# EAGLE design IRK (EAGLE 6.5.0)
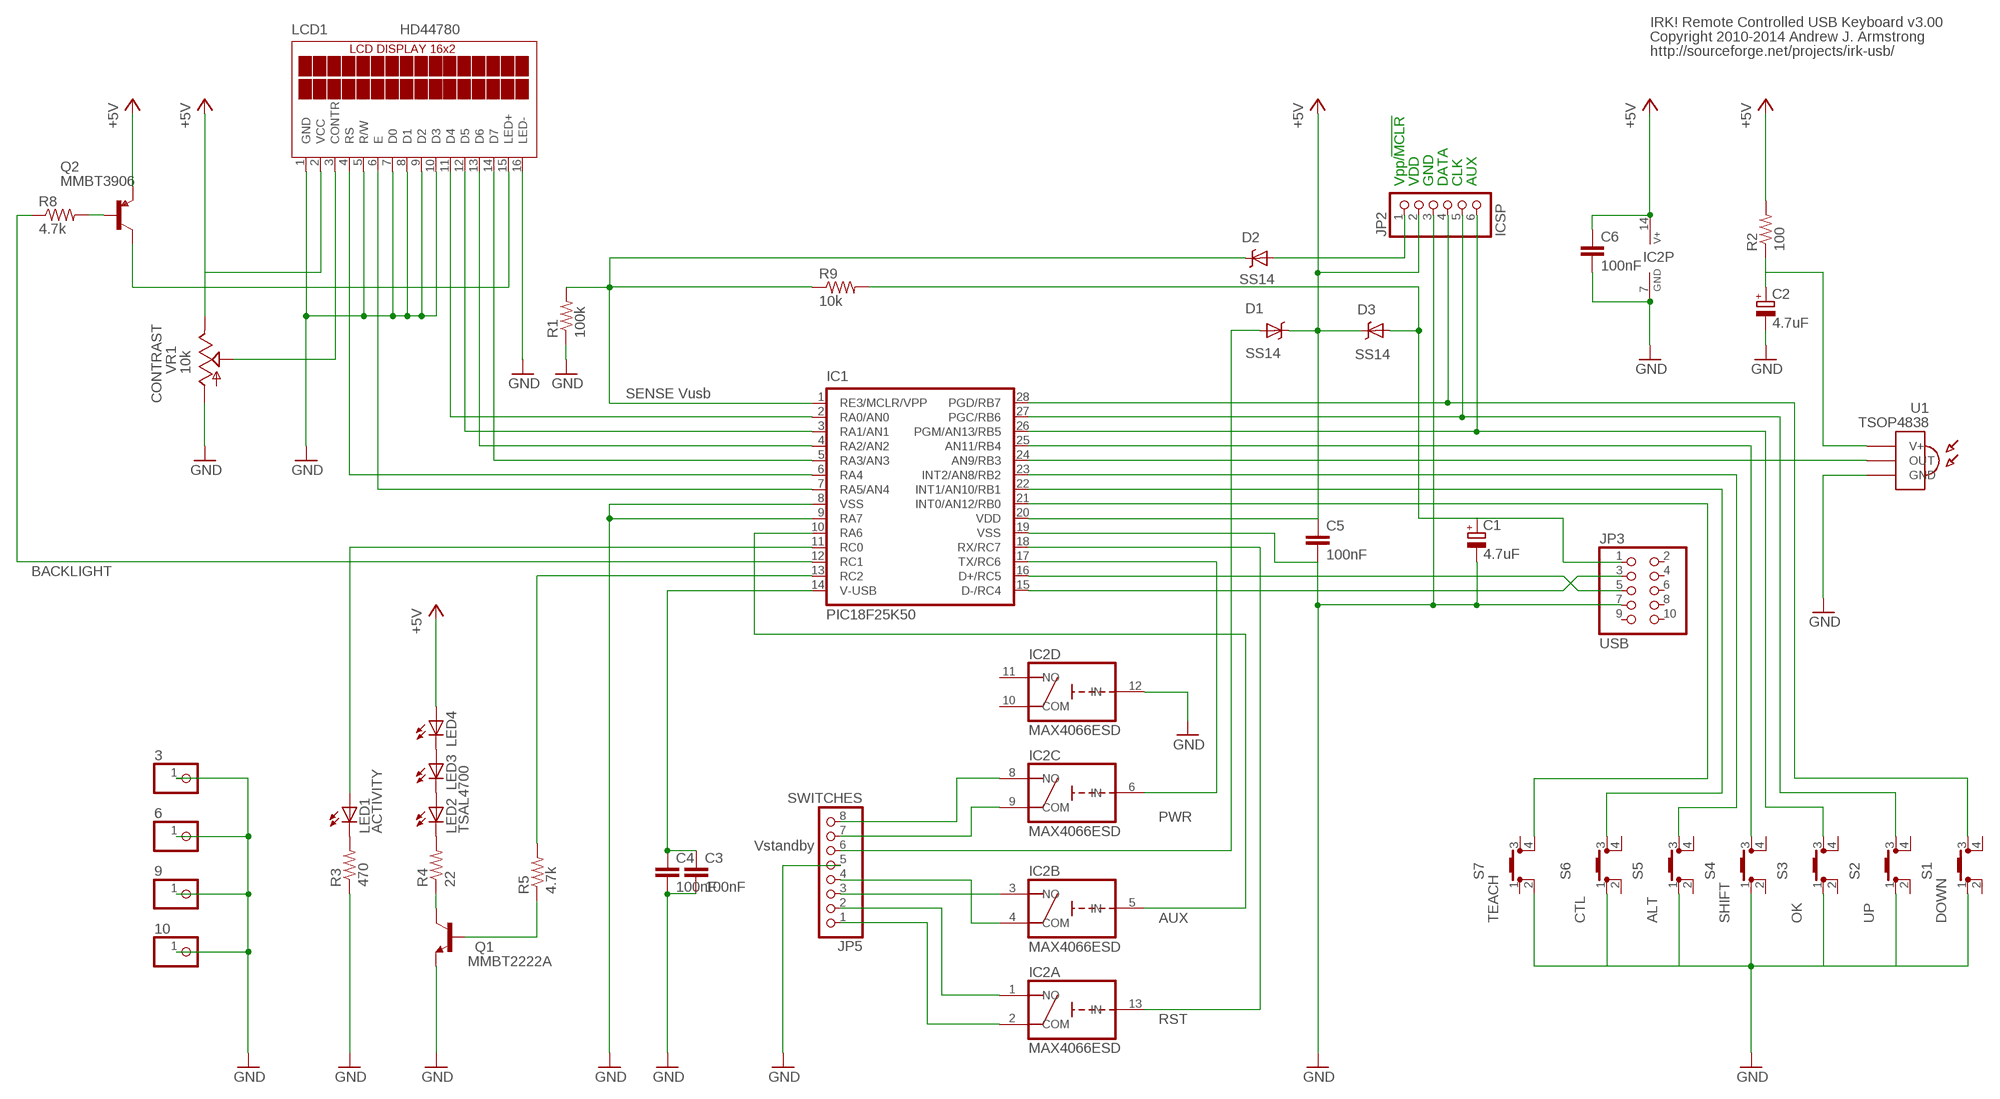
[diagram p0: schematic, sheet 1]

## Parts
3  PINHD-1X1  [1X01]
6  PINHD-1X1  [1X01]
9  PINHD-1X1  [1X01]
10  PINHD-1X1  [1X01]
C1  4.7uF  CPOL-EUSMCA  [SMC_A]
C2  4.7uF  CPOL-EUSMCA  [SMC_A]
C3  100nF  C-EUC0805  [C0805]
C4  100nF  C-EUC0805  [C0805]
C5  100nF  C-EUC0805  [C0805]
C6  100nF  C-EUC0805  [C0805]
D1  SS14  [SMA-DIODE]
D2  SS14  [SMA-DIODE]
D3  SS14  [SMA-DIODE]
IC1  PIC18F25K50  PIC18F25K50SO28W  [SO28W]
IC2  MAX4066ESD  [SO14]
JP2  ICSP  PINHD-1X6  [1X06]
JP3  USB  PINHD-2X5  [2X05]
JP5  SWITCHES  PINHD-1X8  [1X08]
LCD1  HD44780  [LCD_16X2]
LED1  ACTIVITY  LED5MM  [LED5MM]
LED2  TSAL4700  LED5MM  [LED5MM]
LED3  LED5MM  [LED5MM]
LED4  LED5MM  [LED5MM]
Q1  MMBT2222A  [SOT23]
Q2  MMBT3906  MMBT3906SOT23  [SOT23]
R1  100k  R-US_M1206  [M1206]
R2  100  R-US_M1206  [M1206]
R3  470  R-US_M1206  [M1206]
R4  22  R-US_M1206  [M1206]
R5  4.7k  R-US_M1206  [M1206]
R8  4.7k  R-US_M1206  [M1206]
R9  10k  R-US_M1206  [M1206]
S1  DOWN  C&K-PTS525-SM10  [PTH525-SM10]
S2  UP  C&K-PTS525-SM10  [PTH525-SM10]
S3  OK  C&K-PTS525-SM10  [PTH525-SM10]
S4  SHIFT  C&K-PTS525-SM10  [PTH525-SM10]
S5  ALT  C&K-PTS525-SM10  [PTH525-SM10]
S6  CTL  C&K-PTS525-SM10  [PTH525-SM10]
S7  TEACH  C&K-PTS525-SM10  [PTH525-SM10]
U1  TSOP4838  [TSOP18XX]
VR1  10k  TRIMPOT3303W  [3303W]

## Nets
+5V: C5.1 C6.1 D1.K D3.K IC1.20(VDD) IC2.14(P:V+) JP2.2 LCD1.2(VCC) LED4.A Q2.2(E) R2.2 VR1.3(E)
AUX: IC1.10(RA6) IC2.5(B:IN)
GND: 3.1 6.1 9.1 10.1 C1.- C2.- C3.2 C4.2 C5.2 C6.2 IC1.8(VSS) IC1.9(RA7) IC1.19(VSS) IC2.7(P:GND) IC2.12(D:IN) JP2.3 JP3.7 JP5.5 LCD1.1(GND) LCD1.5(R/W) LCD1.7(D0) LCD1.8(D1) LCD1.9(D2) LCD1.10(D3) LCD1.16(LED-) Q1.2(E) R1.1 R3.1 S1.1 S2.1 S3.1 S4.1 S5.1 S6.1 S7.2 U1.GND VR1.1(A)
N$1: IC1.2(RA0/AN0) LCD1.11(D4)
N$2: IC1.3(RA1/AN1) LCD1.12(D5)
N$3: IC1.4(RA2/AN2) LCD1.13(D6)
N$4: IC1.5(RA3/AN3) LCD1.14(D7)
N$5: IC1.6(RA4) LCD1.4(RS)
N$6: IC1.7(RA5/AN4) LCD1.6(E)
N$7: LCD1.3(CONTR) VR1.2(S)
N$8: D2.K IC1.1(RE3/MCLR/VPP) R1.2 R9.1
N$10: IC1.24(AN9/RB3) U1.OUT
N$11: IC2.2(A:COM) JP5.1
N$12: IC1.28(PGD/RB7) JP2.4 S1.3
N$13: IC1.27(PGC/RB6) JP2.5 S2.3
N$14: IC1.26(PGM/AN13/RB5) JP2.6 S3.3
N$15: IC1.25(AN11/RB4) S4.3
N$16: IC1.23(INT2/AN8/RB2) S5.3
N$17: IC1.22(INT1/AN10/RB1) S6.3
N$18: IC1.21(INT0/AN12/RB0) S7.4
N$19: C3.1 C4.1 IC1.14(V-USB)
N$20: LED1.K(C) R3.2
N$21: C1.+ D3.A JP3.1 R9.2
N$22: IC2.1(A:NO) JP5.2
N$23: IC1.16(D+/RC5) JP3.5
N$24: IC1.15(D-/RC4) JP3.3
N$25: LED2.K(C) R4.2
N$26: LED2.A LED3.K(C)
N$27: LED3.A LED4.K(C)
N$28: IC1.13(RC2) R5.2
N$29: Q1.1(B) R5.1
N$30: Q1.3(C) R4.1
N$31: LCD1.15(LED+) Q2.3(C)
N$33: IC2.4(B:COM) JP5.4
N$34: IC1.12(RC1) R8.1
N$35: IC2.3(B:NO) JP5.3
N$36: Q2.1(B) R8.2
N$39: IC2.9(C:COM) JP5.7
N$40: IC2.8(C:NO) JP5.8
N$45: D2.A JP2.1
N$46: IC1.11(RC0) LED1.A
N$50: C2.+ R2.1 U1.VCC(V+)
PWR: IC1.17(TX/RC6) IC2.6(C:IN)
RST: IC1.18(RX/RC7) IC2.13(A:IN)
VSB: D1.A JP5.6
Unconnected: IC2.10(D:COM) IC2.11(D:NO) JP3.2 JP3.4 JP3.6 JP3.8 JP3.9 JP3.10 S1.2 S1.4 S2.2 S2.4 S3.2 S3.4 S4.2 S4.4 S5.2 S5.4 S6.2 S6.4 S7.1 S7.3

## Notes on the sheet
- IRK! Remote Controlled USB Keyboard v3.00
- Copyright 2010-2014 Andrew J. Armstrong
- http://sourceforge.net/projects/irk-usb/
- Vpp/!MCLR | VDD | GND | DATA | CLK | AUX
- SENSE Vusb
- CONTRAST
- BACKLIGHT
- PWR
- Vstandby
- AUX
- RST

## Library data of the parts
3 6 9 10 = pinhead:PINHD-1X1: PIN HEADER
C1 C2 = rcl:CPOL-EU: POLARIZED CAPACITOR, European symbol
C3-C6 = rcl:C-EU: CAPACITOR, European symbol
D1-D3 = irk:SS14: SS14 Schottky Diode
IC1 = irk:PIC18F25K50: PIC18F25K50
IC2 = irk:MAX4066: Quad Bilateral Analog Switch
JP2 = pinhead:PINHD-1X6: PIN HEADER
JP3 = pinhead:PINHD-2X5: PIN HEADER
JP5 = pinhead:PINHD-1X8: PIN HEADER
LCD1 = irk:HD44780: Generic HD44780 16x2 LCD With backlight
LED1-LED4 = led:LED: LED OSRAM: - CHIPLED LG R971, LG N971, LY N971, LG Q971, LY Q971, LO R971, LY R971 LH N974, LH R974 LS Q976, LO Q976, LY Q976 LO Q996 - Hyper CHIPLED LW Q18S LB Q993, LB Q99A, LB R99A - SideLED LS A670, LO A670, LY A670, LG A670, LP A670 LB A673, LV A673, LT A673, LW A673 LH A674 LY A675 LS A676, LA A676, LO A676, LY A676, LW A676 LS A679, LY A679, LG A679 - Hyper Micro SIDELED® LS Y876, LA Y876, LO Y876, LY Y876 LT Y87S - SmartLED LW L88C, LW L88S LB L89C, LB L89S, LG L890 LS L89K, LO L89K, LY L89K LS L896, LA L896, LO L896, LY L896 - TOPLED LS T670, LO T670, LY T670, LG T670, LP T670 LSG T670, LSP T670, LSY T670, LOP T670, LYG T670 LG T671, LOG T671, LSG T671 LB T673, LV T673, LT T673, LW T673 LH T674 LS T676, LA T676, LO T676, LY T676, LB T676, LH T676, LSB T676, LW T676 LB T67C, LV T67C, LT T67C, LS T67K, LO T67K, LY T67K, LW E67C LS E67B, LA E67B, LO E67B, LY E67B, LB E67C, LV E67C, LT E67C LW T67C LS T679, LY T679, LG T679 LS T770, LO T770, LY T770, LG T770, LP T770 LB T773, LV T773, LT T773, LW T773 LH T774 LS E675, LA E675, LY E675, LS T675 LS T776, LA T776, LO T776, LY T776, LB T776 LHGB T686 LT T68C, LB T68C - Hyper Mini TOPLED® LB M676 - Mini TOPLED Santana® LG M470 LS M47K, LO M47K, LY M47K Source: http://www.osram.convergy.de LUXEON: - LUMILED® LXK2-PW12-R00, LXK2-PW12-S00, LXK2-PW14-U00, LXK2-PW14-V00 LXK2-PM12-R00, LXK2-PM12-S00, LXK2-PM14-U00 LXK2-PE12-Q00, LXK2-PE12-R00, LXK2-PE12-S00, LXK2-PE14-T00, LXK2-PE14-U00 LXK2-PB12-K00, LXK2-PB12-L00, LXK2-PB12-M00, LXK2-PB14-N00, LXK2-PB14-P00, LXK2-PB14-Q00 LXK2-PR12-L00, LXK2-PR12-M00, LXK2-PR14-Q00, LXK2-PR14-R00 LXK2-PD12-Q00, LXK2-PD12-R00, LXK2-PD12-S00 LXK2-PH12-R00, LXK2-PH12-S00 LXK2-PL12-P00, LXK2-PL12-Q00, LXK2-PL12-R00 Source: www.luxeon.com KINGBRIGHT: KA-3528ASYC Source: www.kingbright.com
Q1 = irk:MMBT2222A: 2N2222 General Purpose NPN Transistor; DIGIKEY: 568-4509-6-ND; ELEMENT14: 1757934
Q2 = irk:MMBT3906: 2N3906 General Purpose PNP Transistor PNP General Purpose Amplifier 2N3906/ MMBT3906 / PZT3906 (TO-92 / SOT23 / SOT23-3) This device is designed for general purpose amplifier and switching applications at collector currents of 10 mA to 100 mA; DIGIKEY: MMBT3906FSTR-ND; ELEMENT14: 9846832
R1-R5 R8 R9 = rcl:R-US_: RESISTOR, American symbol
S1-S7 = irk:C&K-PTS525: Momentary Switch C&K Switches PTS 525 Series Microminiature Tactile Switch for SMT; CK: PTS525SM10SMTR LFS; DIGIKEY: CKN9104CT-ND; MOUSER: 611-PTS525SM10-LFS
U1 = irk:TSOP4838: IR Receiver and Demodulator
VR1 = irk:TRIMPOT: Trimmer Potentiometer

## Board
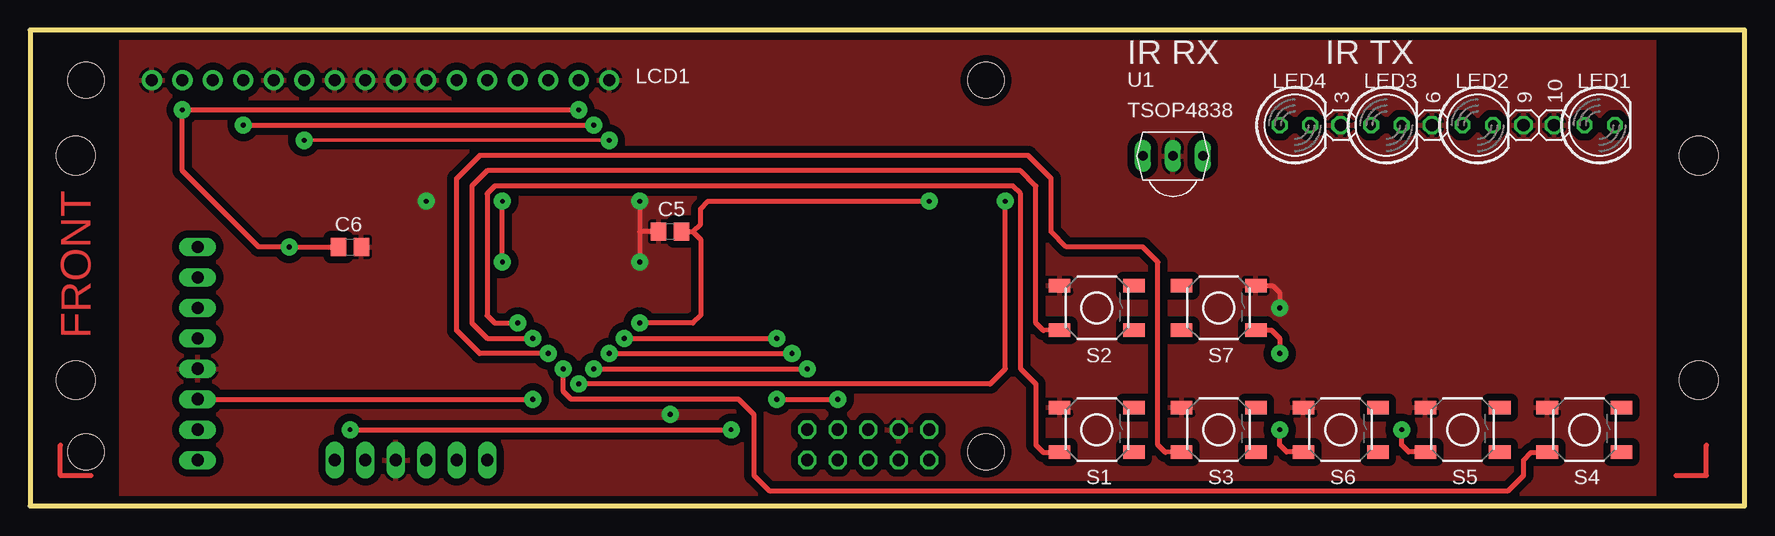
[diagram p1: board, top side]
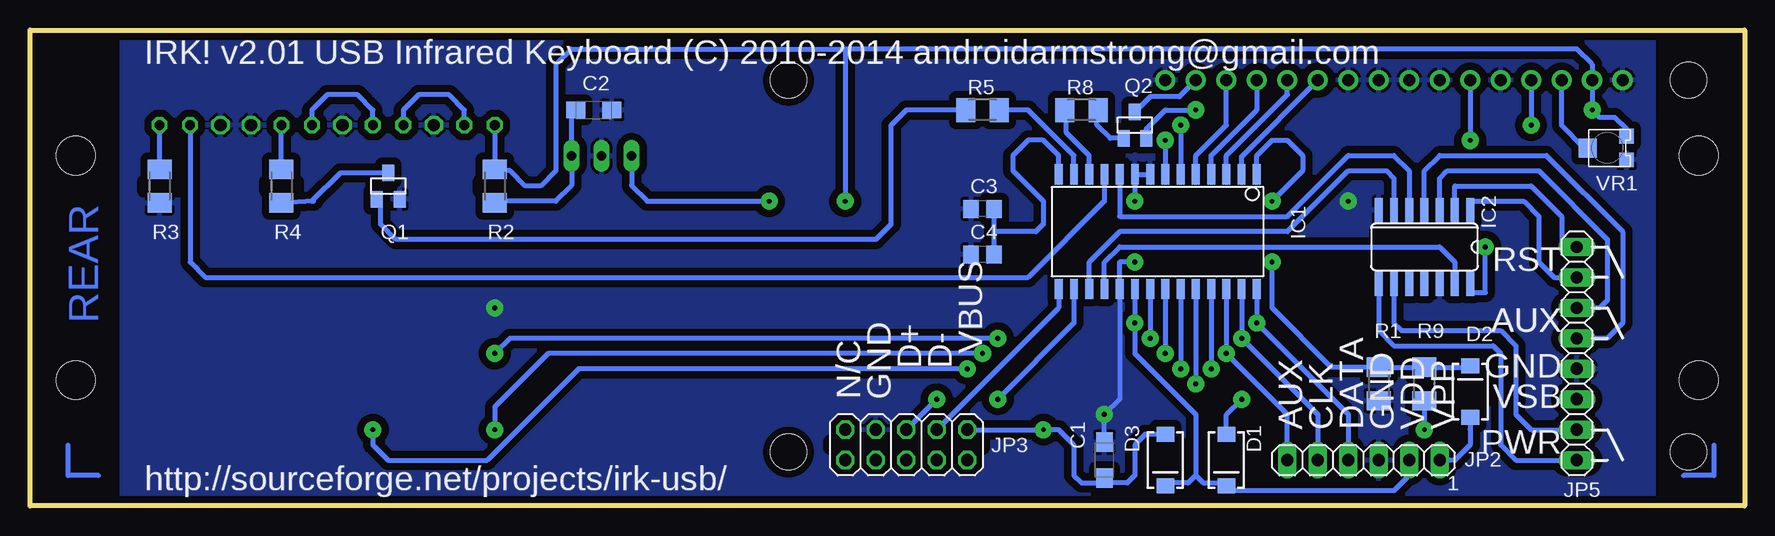
[diagram p2: board, bottom side, seen from below]

Size 142.88 x 39.69 mm. Coordinates in mm from the lower left corner, seen from the top.
Outline: 0,0 142.88,0 142.88,39.69 0,39.69 0,0
Copper layers (1*16): Top 0.035mm / dielectric 1.5mm / Bottom 0.035mm
Design rules "default *": minimum track width 12mil, minimum drill 16mil, track to track 8mil, track to pad 12mil, pad to pad 8mil, via to via 8mil, smd to smd 8mil, copper to edge 20mil, drill to drill 8mil, minimum pad ring 10mil, minimum via ring 20mil, stop-mask expansion 4mil, vias tented up to drill 0mil, thermal gap 10mil
Holes 3.2 mm at 3.81,29.21 3.81,10.48 139.06,29.21 139.06,10.48
bRestrict: area 120.7,26.3 to 123.2,27.1; area 130.8,26.3 to 133.4,27.1; area 63.5,4.8 to 76.2,5.3; area 102.9,26.3 to 105.4,27.1; area 21.6,8.9 to 24.1,10.2; area 41.9,2.5 to 44.5,5.1; area 40.6,19.7 to 52.1,20.3; area 40.6,25.4 to 51.4,26; area 22.9,20.3 to 30.5,22.9; area 25.4,20.3 to 30.5,21; area 47,2.5 to 49.5,5.1
vRestrict: area 86.4,3.8 to 91.4,8.9; area 86.4,14 to 91.4,19.1; area 96.5,14 to 101.6,19.1; area 96.5,3.8 to 101.6,8.9; area 106.7,3.8 to 111.8,8.9; area 116.8,3.8 to 121.9,8.9; area 127,3.8 to 132.1,8.9; area 40.6,19 to 57.1,26.7

### Footprints (pad centres in the part's own frame; a part is rotated, then mirrored left to right if it is on the bottom)
1X01 = drill 1.016 octagon: 1 0,0
SMC_A = smd 1.6 x 1.4: + -1.5,0; - 1.5,0
C0805 = smd 1.3 x 1.5: 1 -0.95,0; 2 0.95,0
SMA-DIODE = smd 1.27 x 1.47: A -2.15,0; K 2.15,0
SO28W = smd 0.65 x 1.7: 1 -7.62,-4.78; 2 -6.35,-4.78; 3 -5.08,-4.78; 4 -3.81,-4.78; 5 -2.54,-4.78; 6 -1.27,-4.78; 7 0,-4.78; 8 1.27,-4.78; 9 2.54,-4.78; 10 3.81,-4.78; 11 5.08,-4.78; 12 6.35,-4.78; 13 7.62,-4.78; 14 8.89,-4.78; 15 8.89,4.78; 16 7.62,4.78; 17 6.35,4.78; 18 5.08,4.78; 19 3.81,4.78; 20 2.54,4.78; 21 1.27,4.78; 22 0,4.78; 23 -1.27,4.78; 24 -2.54,4.78; 25 -3.81,4.78; 26 -5.08,4.78; 27 -6.35,4.78; 28 -7.62,4.78
SO14 = smd 0.66 x 2.032: 1 -3.81,-3.073; 2 -2.54,-3.073; 3 -1.27,-3.073; 4 0,-3.073; 5 1.27,-3.073; 6 2.54,-3.073; 7 3.81,-3.073; 8 3.81,3.073; 9 2.54,3.073; 10 1.27,3.073; 11 0,3.073; 12 -1.27,3.073; 13 -2.54,3.073; 14 -3.81,3.073
1X06 = drill 1.016 long: 1 -6.35,0; 2 -3.81,0; 3 -1.27,0; 4 1.27,0; 5 3.81,0; 6 6.35,0
2X05 = drill 1.016 octagon: 1 -5.08,-1.27; 2 -5.08,1.27; 3 -2.54,-1.27; 4 -2.54,1.27; 5 0,-1.27; 6 0,1.27; 7 2.54,-1.27; 8 2.54,1.27; 9 5.08,-1.27; 10 5.08,1.27
1X08 = drill 1.016 long: 1 -8.89,0; 2 -6.35,0; 3 -3.81,0; 4 -1.27,0; 5 1.27,0; 6 3.81,0; 7 6.35,0; 8 8.89,0
LCD_16X2 = drill 1 pad 1.676: 1 -32,15.5; 2 -29.46,15.5; 3 -26.92,15.5; 4 -24.38,15.5; 5 -21.84,15.5; 6 -19.3,15.5; 7 -16.76,15.5; 8 -14.22,15.5; 9 -11.68,15.5; 10 -9.14,15.5; 11 -6.6,15.5; 12 -4.06,15.5; 13 -1.52,15.5; 14 1.02,15.5; 15 3.56,15.5; 16 6.1,15.5 | hole 3: -37.5,-15.5; 37.5,-15.5; -37.5,15.5; 37.5,15.5
LED5MM = drill 0.813 octagon: A -1.27,0; K 1.27,0
SOT23 = smd 1 x 1.4: 1 -0.95,-1.1; 2 0.95,-1.1; 3 0,1.1
M1206 = smd 1.6 x 2: 1 -1.4,0; 2 1.4,0
PTH525-SM10 = smd 1.803 x 1.118: 1 -3.099,1.854; 2 3.099,1.854; 3 -3.099,-1.854; 4 3.099,-1.854
TSOP18XX = drill 0.813 long: GND -0.001,-0.027; OUT -2.501,-0.027; VCC 2.499,-0.027
3303W = smd 1.219 x 1.219: 1 -0.991,-1.6; 3 0.991,-1.6 | smd 1.6 x 1.499: 2 0,1.638

### Placement (x,y rotation side)
3  109.22,31.75 0 top
6  116.84,31.75 0 top
9  124.46,31.75 0 top
10  127,31.75 0 top
C1  53.34,3.81 90 bottom
C2  95.89,33.02 0 bottom
C3  63.5,24.77 180 bottom
C4  63.5,20.95 180 bottom
C5  53.34,22.86 180 top
C6  26.67,21.59 0 top
D1  43.18,3.81 270 bottom
D2  22.86,9.53 90 bottom
D3  48.26,3.81 270 bottom
IC1  48.26,22.86 180 bottom
IC2  26.67,21.59 180 bottom
JP2  31.75,3.81 180 bottom
JP3  69.85,5.08 180 bottom
JP5  13.97,12.7 270 bottom
LCD1  42.16,19.99 0 top
LED1  130.81,31.75 0 top
LED2  120.65,31.75 0 top
LED3  113.03,31.75 0 top
LED4  105.41,31.75 0 top
Q1  113.03,26.67 0 bottom
Q2  50.8,31.75 0 bottom
R1  30.48,10.16 90 bottom
R2  104.14,26.67 90 bottom
R3  132.08,26.67 90 bottom
R4  121.92,26.67 90 bottom
R5  63.5,33.02 0 bottom
R8  55.24,33.02 0 bottom
R9  26.67,10.16 270 bottom
S1  88.9,6.35 0 top
S2  88.9,16.51 0 top
S3  99.06,6.35 0 top
S4  129.54,6.35 0 top
S5  119.38,6.35 0 top
S6  109.22,6.35 0 top
S7  99.06,16.51 0 top
U1  95.25,29.21 0 top
VR1  11.43,29.84 90 bottom

### Tracks (layer width: path | path; a pad name or v marks a point on that pad's centre or on a via)
+5V  (via drill 0.41, 0.41 pad 0.81)
  Top 0.406: v45.72,33.02 v12.7,33.02 12.7,27.94 19.05,21.59 v21.59,21.59 C6.1 | 55.24,22.86 55.88,23.5 55.88,24.77 56.52,25.4 v74.93,25.4 | C5.1 55.24,22.86 | 55.24,22.86 55.88,22.23 55.88,15.88 55.24,15.24 v50.8,15.24
  Bottom 0.406: 74.93,38.1 97.79,38.1 99.06,36.83 99.06,27.94 100.33,26.67 101.6,26.67 102.87,27.94 104.01,27.94 R2.2 LED4.A | 74.93,38.1 v74.93,25.4 | 74.93,38.1 13.97,38.1 12.7,36.83 LCD1.2 | Q2.2 49.85,31.43 48.26,33.02 v45.72,33.02 | IC2.14 22.86,17.78 21.59,17.78 v21.59,21.59 | LCD1.2 | VR1.3 9.83,31.42 10.79,32.38 12.06,32.38 v12.7,33.02 LCD1.2 | JP2.2 27.94,2.54 29.21,1.27 42.79,1.27 D1.K 43.42,1.91 45.09,1.91 45.72,2.54 | 45.72,2.54 45.72,7.62 50.8,12.7 v50.8,15.24 IC1.20 | 45.72,2.54 46.35,1.91 48.02,1.91 D3.K
AUX
  Bottom 0.406: IC2.5 27.94,27.94 29.21,29.21 33.02,29.21 38.1,24.13 52.07,24.13 IC1.10
GND  (via drill 0.41, 0.41 pad 0.81)
  Top 0.406: v50.8,25.4 50.8,22.86 | 50.8,22.86 v50.8,20.32 | S7.2 103.56,18.36 104.14,17.78 v104.14,16.51 | C5.2 50.8,22.86
  Bottom 0.406: v50.8,20.32 52.07,20.32 IC1.19 52.07,8.89 v53.34,7.62 C1.- | v50.8,25.4 IC1.9 IC1.8
  other vias: 33.02,25.4
  pour Top (isolate 0.61): 7.62,0 135.35,0 135.35,39.52 7.62,39.52
  pour Bottom (isolate 0.61): 7.62,0 135.2,0.16 135.2,39.83 7.62,39.67
N$1
  Bottom 0.406: LCD1.11 41.91,29.14 IC1.2
N$2
  Bottom 0.406: LCD1.12 38.1,34.29 43.18,29.21 IC1.3
N$3
  Bottom 0.406: LCD1.13 40.64,33.02 44.45,29.21 IC1.4
N$4
  Bottom 0.406: LCD1.14 43.18,31.75 45.72,29.21 IC1.5
N$5  (via drill 0.41)
  Top 0.406: v17.78,31.75 v46.99,31.75
  Bottom 0.406: LCD1.4 v17.78,31.75 | v46.99,31.75 IC1.6
N$6  (via drill 0.41)
  Top 0.305: v22.86,30.48 v48.26,30.48
  Bottom 0.406: LCD1.6 v22.86,30.48 | v48.26,30.48 IC1.7
N$7
  Bottom 0.406: 13.08,29.27 VR1.2 13.34,29.84 15.24,31.75 LCD1.3
N$8  (via drill 0.41)
  Top 0.406: v39.37,20.32 v39.37,25.4
  Bottom 0.406: v39.37,20.32 39.37,16.51 34.42,11.56 R1.2 R9.1 22.98,11.56 D2.K | v39.37,25.4 36.83,27.94 36.83,29.21 38.1,30.48 39.37,30.48 40.64,29.21 IC1.1
N$10  (via drill 0.41)
  Top 0.406: v45.72,10.16 80.01,10.16 81.28,11.43 v81.28,25.4
  Bottom 0.406: v81.28,25.4 91.44,25.4 92.71,26.67 | 92.71,26.67 92.75,26.71 | U1.OUT 92.74,29.18 92.71,29.21 92.71,26.67 | IC1.24 v45.72,10.16
N$11
  Bottom 0.406: IC2.2 24.13,26.67 17.78,26.67 15.24,24.13 15.24,21.59 JP5.1
N$12  (via drill 0.41)
  Top 0.406: v40.64,15.24 38.73,15.24 38.1,15.88 38.1,26.04 38.73,26.67 81.92,26.67 82.55,26.04 82.55,11.43 83.82,10.16 83.82,5.08 84.45,4.45 85.75,4.45 S1.3
  Bottom 0.406: JP2.4 33.02,7.62 v40.64,15.24 IC1.28
N$13  (via drill 0.41)
  Top 0.406: S2.3 84.45,14.61 83.82,15.24 83.82,26.67 82.55,27.94 38.1,27.94 36.83,26.67 36.83,15.24 38.1,13.97 v41.91,13.97
  Bottom 0.406: JP2.5 35.56,7.62 v41.91,13.97 IC1.27
N$14  (via drill 0.41)
  Top 0.406: S3.3 94.61,4.45 93.98,5.08 93.98,20.32 92.71,21.59 86.36,21.59 85.09,22.86 85.09,27.3 83.19,29.21 37.47,29.21 35.56,27.3 35.56,14.61 37.47,12.7 v43.18,12.7
  Bottom 0.406: JP2.6 38.1,7.62 v43.18,12.7 IC1.26
N$15  (via drill 0.41)
  Top 0.406: v44.45,11.43 44.45,9.53 45.09,8.89 59.05,8.89 60.33,7.62 60.33,2.54 61.59,1.27 123.19,1.27 124.46,2.54 124.46,3.81 125.09,4.45 125.73,4.45 S4.3
  Bottom 0.406: IC1.25 v44.45,11.43
N$16  (via drill 0.41)
  Top 0.406: v46.99,11.43 v64.77,11.43 | S5.3 114.88,4.5 114.3,5.08 v114.3,6.35
  Bottom 0.406: v64.77,11.43 97.16,11.43 104.78,3.81 113.03,3.81 114.3,5.08 v114.3,6.35 | IC1.23 v46.99,11.43
N$17  (via drill 0.41)
  Top 0.406: v48.26,12.7 v63.5,12.7 | S6.3 104.72,4.5 104.14,5.08 v104.14,6.35
  Bottom 0.406: v104.14,6.35 104.14,8.26 99.69,12.7 v63.5,12.7 | IC1.22 v48.26,12.7
N$18  (via drill 0.41)
  Top 0.406: v49.53,13.97 v62.23,13.97 | S7.4 103.45,14.66 104.14,13.97 v104.14,12.7
  Bottom 0.406: v62.23,13.97 102.87,13.97 v104.14,12.7 | IC1.21 v49.53,13.97
N$19
  Bottom 0.406: C3.1 62.55,22.86 | 62.55,22.86 C4.1 | 62.55,22.86 59.05,22.86 58.42,23.5 58.42,25.4 60.96,27.94 60.96,29.21 59.69,30.48 58.42,30.48 57.15,29.21 IC1.14
N$20
  Bottom 0.406: R3.2 LED1.K
N$21  (via drill 0.41)
  Top 0.406: v26.67,6.35 v58.42,6.35
  Bottom 0.406: R9.2 v26.67,6.35 | D3.A 49.92,5.96 50.8,5.08 50.8,2.54 51.44,1.91 52.94,1.91 C1.+ | 53.11,2.54 C1.+ | JP3.1 v58.42,6.35 57.15,6.35 55.88,5.08 55.88,2.54 55.24,1.91 53.74,1.91 C1.+
N$22
  Bottom 0.406: IC2.1 22.86,25.4 18.41,25.4 17.14,24.13 17.14,20.32 15.88,19.05 JP5.2
N$23  (via drill 0.41)
  Top 0.406: v62.23,8.89 v67.31,8.89
  Bottom 0.406: v62.23,8.89 55.88,15.24 IC1.16 | v67.31,8.89 JP3.5
N$24
  Bottom 0.406: JP3.3 57.15,16.51 IC1.15
N$25
  Bottom 0.406: R4.2 LED2.K
N$26
  Bottom 0.406: LED3.K 114.3,33.02 115.57,34.29 118.11,34.29 119.38,33.02 LED2.A
N$27
  Bottom 0.406: LED4.K 106.68,33.02 107.95,34.29 110.49,34.29 111.76,33.02 LED3.A
N$28
  Bottom 0.406: R5.2 59.69,33.02 55.88,29.21 IC1.13
N$29
  Bottom 0.406: Q1.1 113.67,25.25 113.67,23.5 112.39,22.23 72.39,22.23 71.12,23.5 71.12,31.75 69.85,33.02 R5.1
N$30
  Bottom 0.406: Q1.3 117.01,27.77 119.38,25.4 119.25,25.4 R4.1
N$31
  Bottom 0.406: Q2.3 49.53,34.12 47.09,34.12 LCD1.15
N$33
  Bottom 0.406: IC2.4 26.67,27.94 25.4,29.21 16.51,29.21 10.16,22.86 10.16,15.24 11.43,13.97 JP5.4
N$34
  Bottom 0.406: R8.1 56.52,32.89 56.52,31.11 54.61,29.21 IC1.12
N$35
  Bottom 0.406: IC2.3 25.4,27.3 24.77,27.94 17.14,27.94 11.43,22.23 11.43,17.14 12.06,16.51 JP5.3
N$36
  Bottom 0.406: Q2.1 52.88,30.65 53.98,31.75 53.98,32.89 R8.2
N$39
  Bottom 0.406: IC2.9 29.21,15.24 28.57,14.61 20.32,14.61 19.05,13.34 19.05,7.62 17.78,6.35 JP5.7
N$40
  Bottom 0.406: IC2.8 30.48,14.61 29.21,13.34 20.95,13.34 20.32,12.7 20.32,5.08 19.05,3.81 JP5.8
N$41
  Top 0.406: 2.54,5.08 2.54,2.54 5.08,2.54
N$42
  Top 0.406: 137.16,2.54 139.7,2.54 139.7,5.08
N$43
  Bottom 0.406: 2.54,5.08 2.54,2.54 5.08,2.54
N$44
  Bottom 0.406: 137.16,2.54 139.7,2.54 139.7,5.08
N$45
  Bottom 0.406: D2.A 22.86,6.35 22.86,5.08 24.13,3.81 JP2.1
N$46
  Bottom 0.406: LED1.A 129.54,20.32 128.27,19.05 59.69,19.05 53.34,25.4 IC1.11
N$50
  Bottom 0.406: R2.1 104.01,25.4 99.06,25.4 97.75,26.71 U1.VCC 97.75,32.66 C2.+
PWR
  Bottom 0.406: IC2.6 29.21,27.3 29.84,27.94 33.02,27.94 38.1,22.86 52.07,22.86 54.61,20.32 IC1.17
RST
  Bottom 0.406: IC2.13 24.13,20.32 25.4,21.59 52.07,21.59 53.34,20.32 IC1.18
VSB  (via drill 0.41 pad 0.81)
  Top 0.406: JP5.6 v41.91,8.89
  Bottom 0.406: D1.A 43.18,7.62 v41.91,8.89

### Text on the board
Top: FRONT
Bottom: REAR
_tsilk: IR RX | IR TX
_bsilk: IRK! v2.01 USB Infrared Keyboard (C) 2010-2014 androidarmstrong@gmail.com | RST | AUX | AUX | GND | VBUS | D- | D+ | VSB | GND | N/C | PWR | VPP | VDD | GND | DATA | CLK | AUX | 1 | http://sourceforge.net/projects/irk-usb/